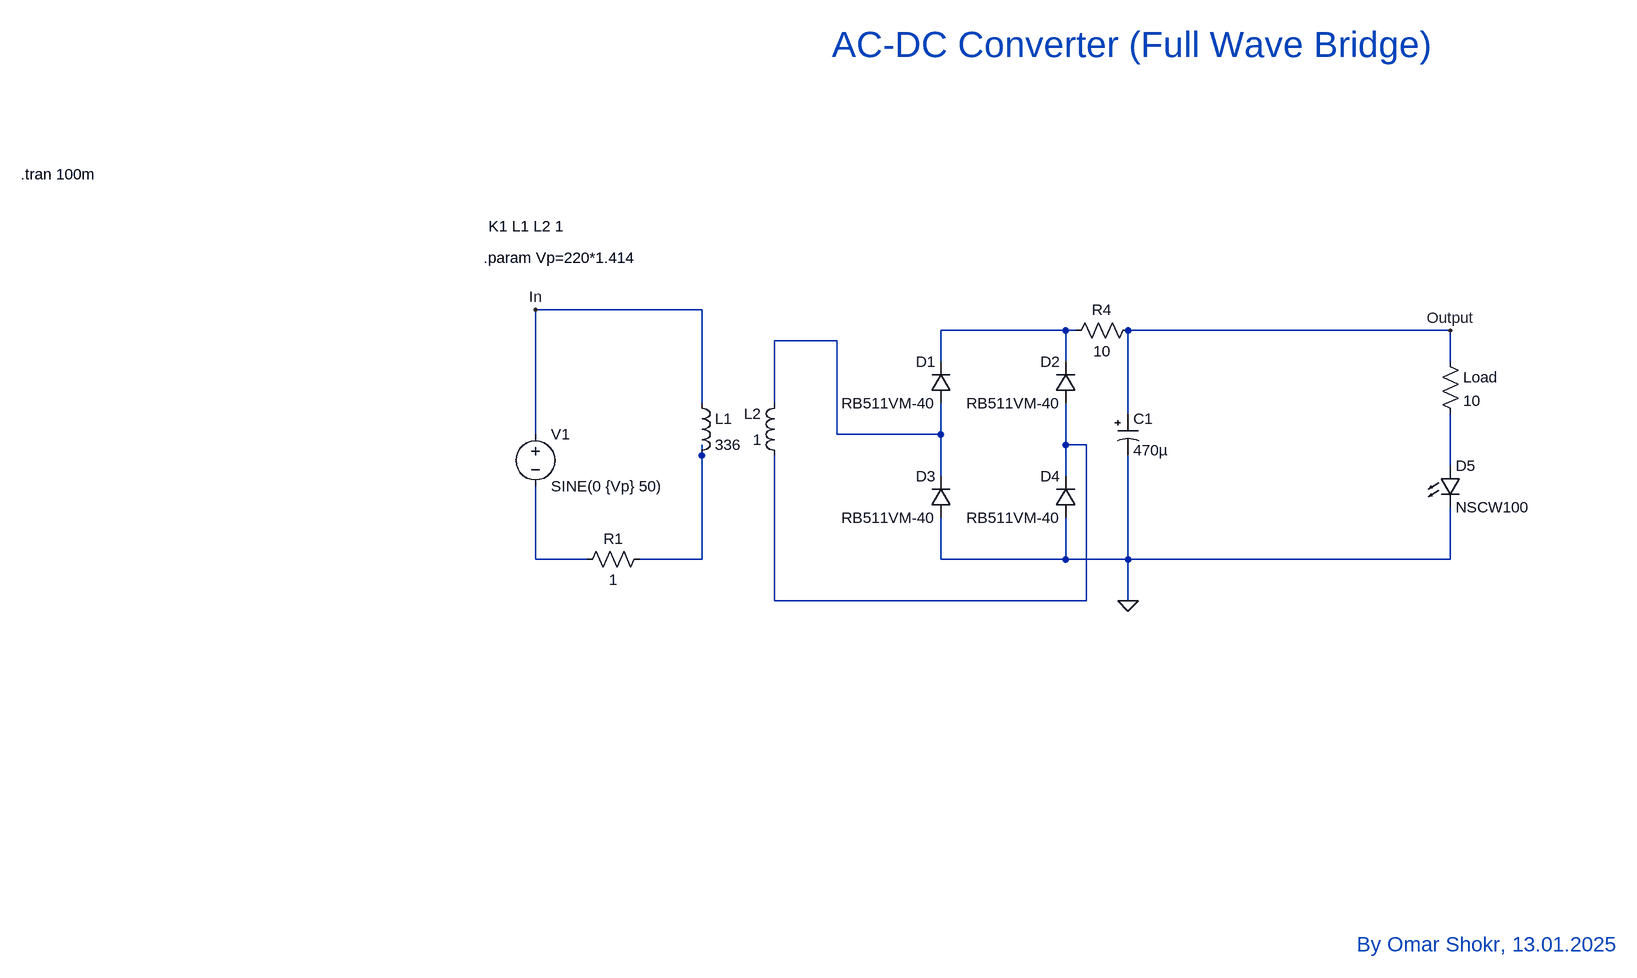
[diagram p0: schematic AC_DC_FullWave_Omar.asc]
AC_DC_FullWave_Omar.asc, the LTspice schematic file:
Version 4.1
SHEET 1 1196 1012
WIRE -240 16 -496 16
WIRE 320 48 128 48
WIRE 336 48 320 48
WIRE 912 48 416 48
WIRE -32 64 -128 64
WIRE 128 96 128 48
WIRE 320 96 320 48
WIRE 912 96 912 48
WIRE -240 160 -240 16
WIRE -128 160 -128 64
WIRE 416 176 416 48
WIRE -496 208 -496 16
WIRE -32 208 -32 64
WIRE 128 208 128 160
WIRE 128 208 -32 208
WIRE 320 224 320 160
WIRE 352 224 320 224
WIRE -240 240 -240 224
WIRE 912 256 912 176
WIRE 128 272 128 208
WIRE 320 272 320 224
WIRE -496 400 -496 288
WIRE -416 400 -496 400
WIRE -240 400 -240 240
WIRE -240 400 -336 400
WIRE 128 400 128 336
WIRE 320 400 320 336
WIRE 320 400 128 400
WIRE 416 400 416 240
WIRE 416 400 320 400
WIRE 912 400 912 320
WIRE 912 400 416 400
WIRE -128 464 -128 240
WIRE 352 464 352 224
WIRE 352 464 -128 464
WIRE 416 464 416 400
FLAG -496 16 In
FLAG 416 464 0
FLAG 912 48 Output
SYMBOL diode 144 160 R180
WINDOW 0 24 64 Left 2
WINDOW 3 24 0 Left 2
SYMATTR InstName D1
SYMATTR Value RB511VM-40
SYMATTR Description Diode
SYMATTR Type diode
SYMBOL voltage -496 192 R0
WINDOW 123 0 0 Left 0
WINDOW 39 0 0 Left 0
SYMATTR InstName V1
SYMATTR Value SINE(0 {Vp} 50)
SYMBOL ind -256 144 R0
SYMATTR InstName L1
SYMATTR Value 336
SYMATTR Type ind
SYMBOL ind -112 256 R180
WINDOW 0 36 80 Left 2
WINDOW 3 36 40 Left 2
SYMATTR InstName L2
SYMATTR Value 1
SYMATTR Type ind
SYMBOL res -320 384 R90
WINDOW 0 0 56 VBottom 2
WINDOW 3 32 56 VTop 2
SYMATTR InstName R1
SYMATTR Value 1
SYMBOL polcap 400 176 R0
SYMATTR InstName C1
SYMATTR Value 470µ
SYMBOL LED 896 256 R0
SYMATTR InstName D5
SYMATTR Value NSCW100
SYMBOL res 896 80 R0
SYMATTR InstName Load
SYMATTR Value 10
SYMBOL res 320 64 R270
WINDOW 0 32 56 VTop 2
WINDOW 3 0 56 VBottom 2
SYMATTR InstName R4
SYMATTR Value 10
SYMBOL diode 144 336 R180
WINDOW 0 24 64 Left 2
WINDOW 3 24 0 Left 2
SYMATTR InstName D3
SYMATTR Value RB511VM-40
SYMATTR Description Diode
SYMATTR Type diode
SYMBOL diode 336 160 R180
WINDOW 0 24 64 Left 2
WINDOW 3 24 0 Left 2
SYMATTR InstName D2
SYMATTR Value RB511VM-40
SYMATTR Description Diode
SYMATTR Type diode
SYMBOL diode 336 336 R180
WINDOW 0 24 64 Left 2
WINDOW 3 24 0 Left 2
SYMATTR InstName D4
SYMATTR Value RB511VM-40
SYMATTR Description Diode
SYMATTR Type diode
TEXT -576 -64 Left 2 !.param Vp=220*1.414
TEXT -1288 -192 Left 2 !.tran 100m
TEXT -568 -112 Left 2 !K1 L1 L2 1
TEXT -40 -392 Left 5 ;AC-DC Converter (Full Wave Bridge)
TEXT 768 992 Left 3 ;By Omar Shokr, 13.01.2025

The netlist it stands for:
* AC_DC_FullWave_Omar.asc
D1 N002 N001 RB511VM-40
V1 In N006 SINE(0 {Vp} 50)
L1 In N004 336
L2 N003 N002 1
R1 N004 N006 1
C1 Output 0 470µ
D5 N005 0 NSCW100
R§Load Output N005 10
R4 N001 Output 10
D3 0 N002 RB511VM-40
D2 N003 N001 RB511VM-40
D4 0 N003 RB511VM-40
.model D D
.lib standard.dio
.param Vp=220*1.414
.tran 100m
K1 L1 L2 1
* AC-DC Converter (Full Wave Bridge)
* By Omar Shokr, 13.01.2025
.backanno
.end